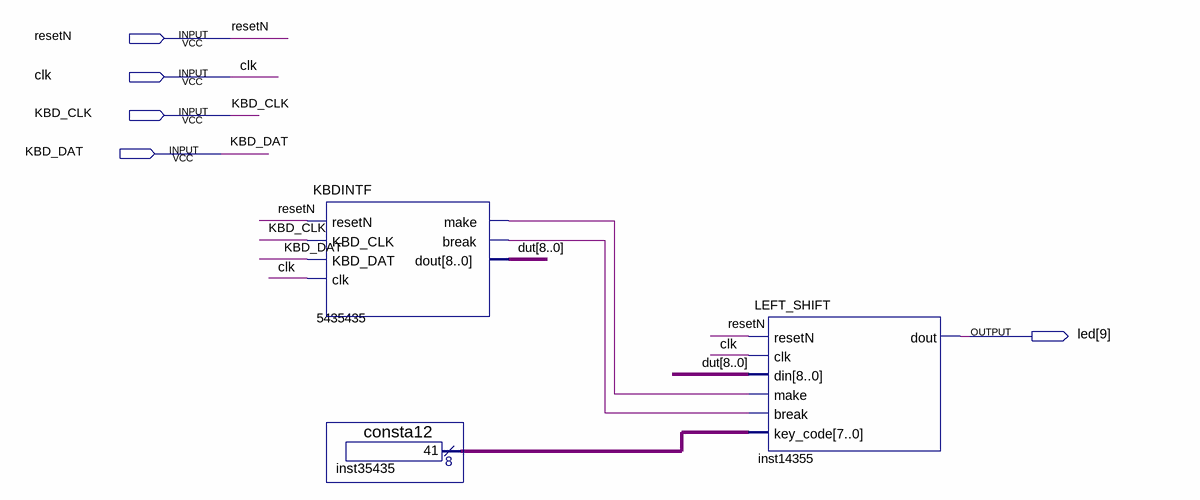
[diagram p0: schematic sheet]
// Quartus schematic Test_Toggle.bdf as structural Verilog: 3 symbols, 5 pins
module Test_Toggle (
  input  resetN,
  input  clk,
  input  KBD_CLK,
  input  KBD_DAT,
  output [9:9] led
);

  wire n5435435_break, n5435435_make;
  wire [7:0] inst35435_result;
  wire [8:0] dut;

  KBDINTF u_5435435 (
    .resetN(resetN), .KBD_CLK(KBD_CLK), .KBD_DAT(KBD_DAT), .clk(clk), .make(n5435435_make),
    .\break (n5435435_break), .dout(dut));
  consta12 inst35435 (.result(inst35435_result));
  LEFT_SHIFT inst14355 (
    .resetN(resetN), .clk(clk), .din(dut), .make(n5435435_make), .\break (n5435435_break),
    .key_code(inst35435_result), .dout(led[9]));
endmodule
